# Altium project Watch.PrjPcb
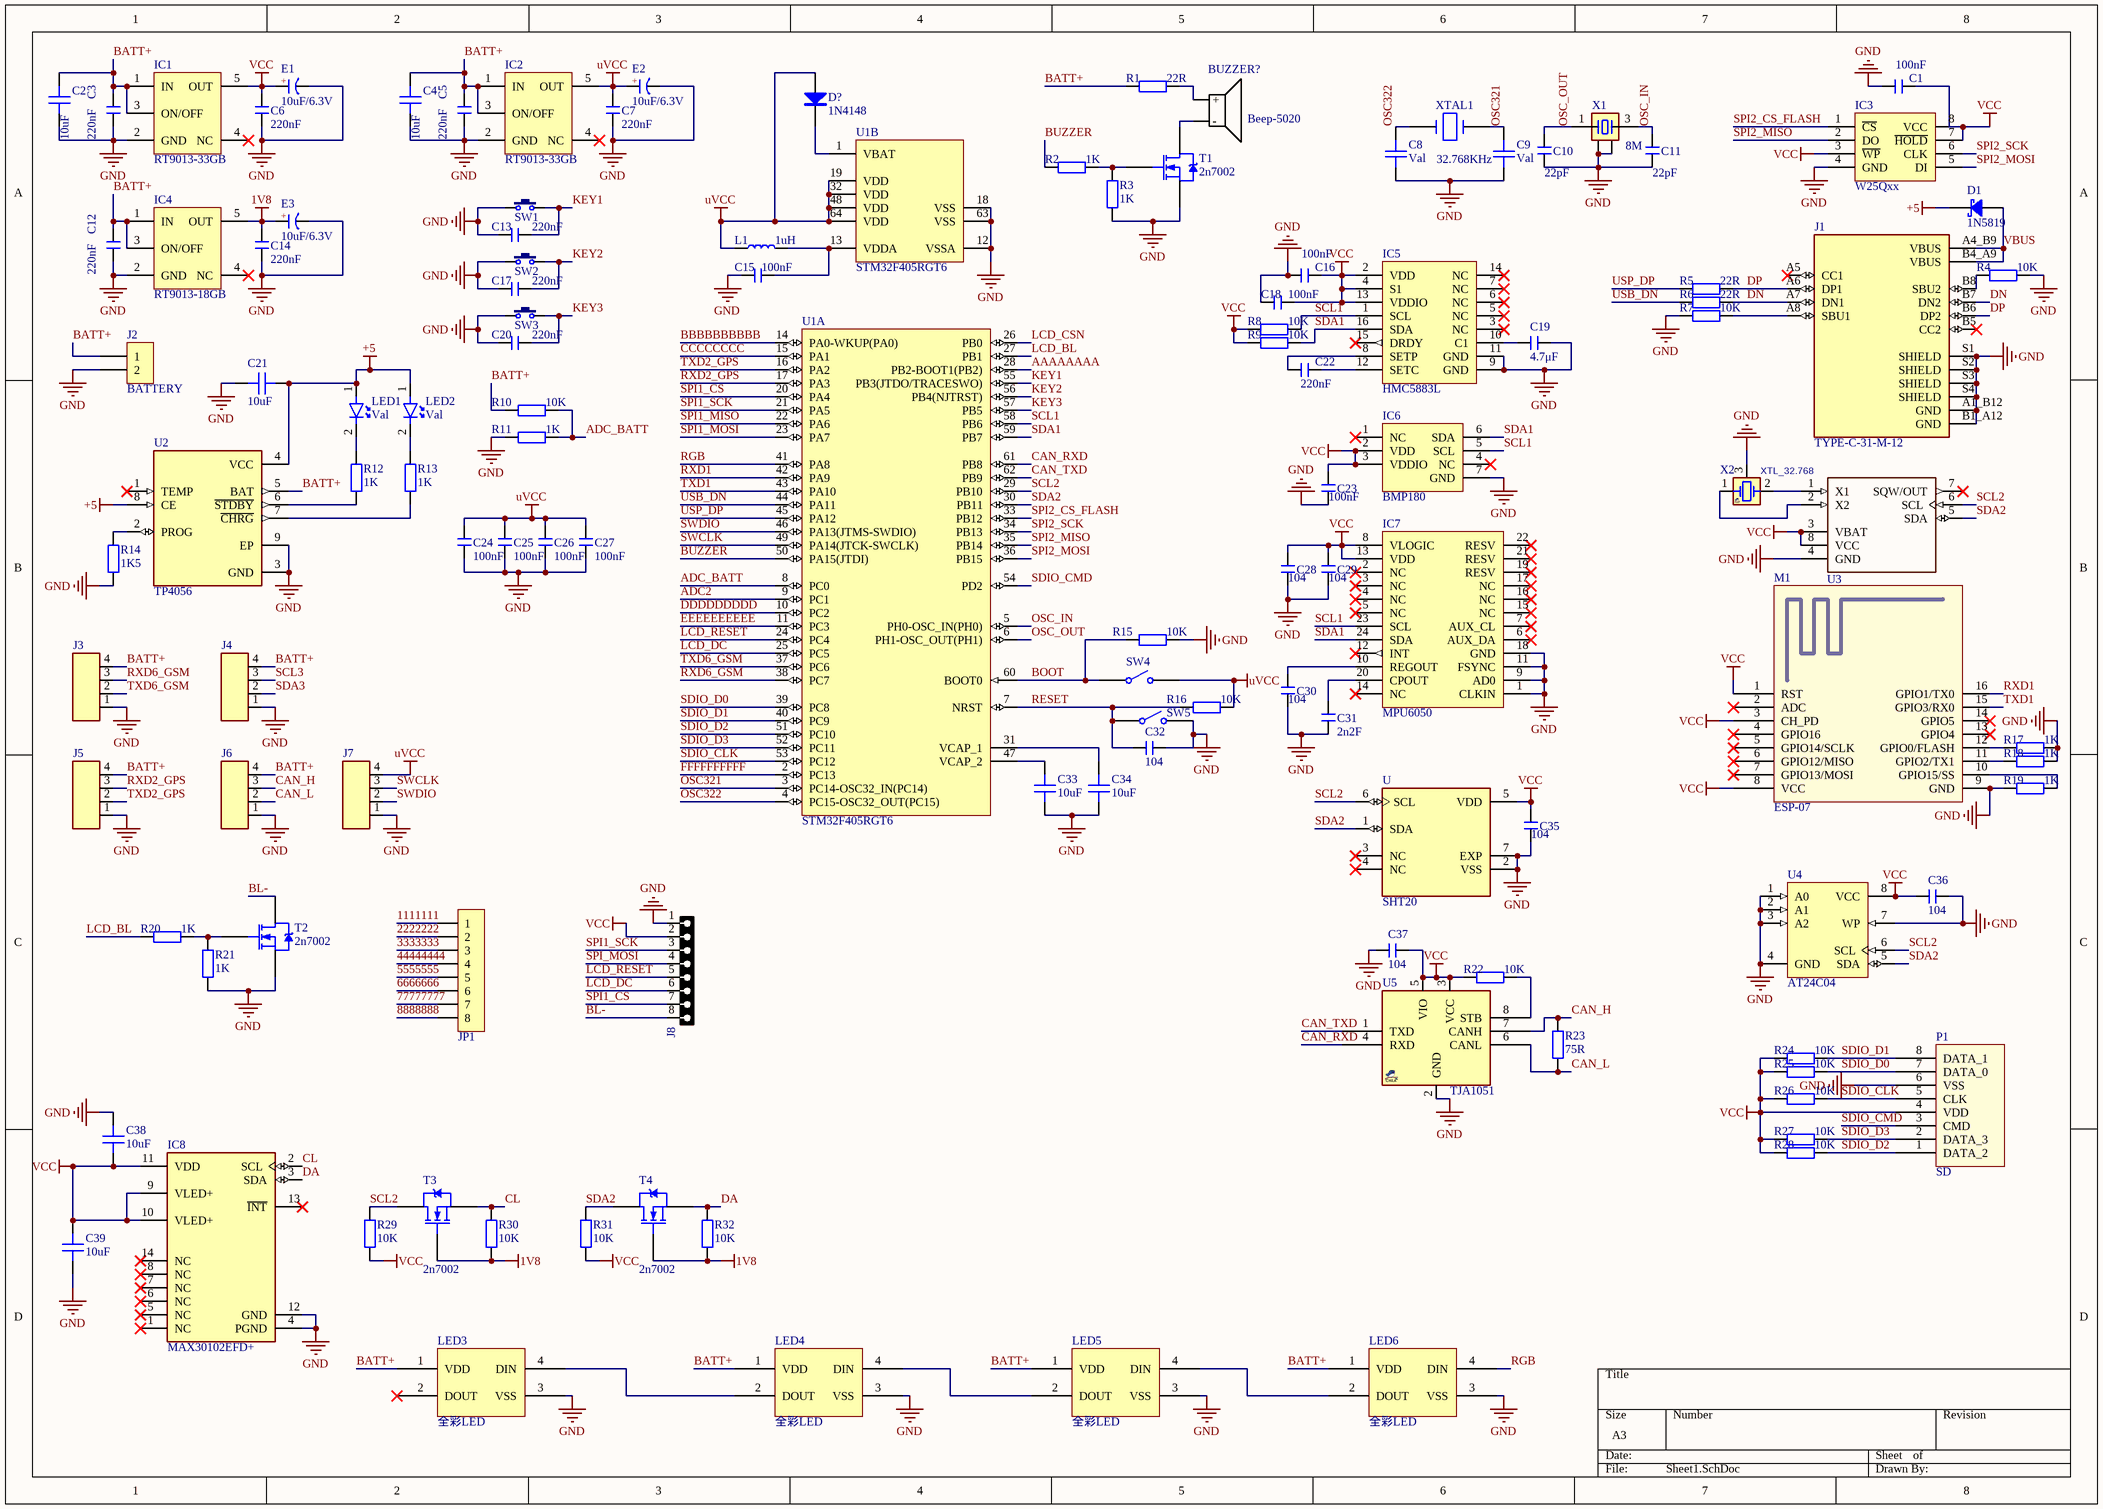
[diagram p0: Sheet1.SchDoc]
1 sheet, 121 parts. Net scope: global (net labels, ports and power ports of the same name join across sheets).
Board file: PCB1.PcbDoc

## Sheet Sheet1.SchDoc
size A3

### Parts
BUZZER?  Beep-5020  [5020BUZZER]
C1  100nF  [C 0603_L]
C2  10uF  [CAP 0805_2012]
C3  220nF  [C 0603_L]
C4  10uF  [CAP 0805_2012]
C5  220nF  [C 0603_L]
C6  220nF  [C 0603_L]
C7  220nF  [C 0603_L]
C8  Val  [C0402]
C9  Val  [C0402]
C10  22pF  [C 0603_L]
C11  22pF  [C 0603_L]
C12  220nF  [C 0603_L]
C13  220nF  [C 0603_L]
C14  220nF  [C 0603_L]
C15  100nF  [C 0603_L]
C16  100nF  [C 0603_L]
C17  220nF  [C 0603_L]
C18  100nF  [C 0603_L]
C19  4.7μF  [C 0603_L]
C20  220nF  [C 0603_L]
C21  10uF  [CAP 0805_2012]
C22  220nF  [C 0603_L]
C23  100nF  [C 0603_L]
C24  100nF  [C 0603_L]
C25  100nF  [C 0603_L]
C26  100nF  [C 0603_L]
C27  100nF  [C 0603_L]
C28  104  [C 0603_L]
C29  104  [C 0603_L]
C30  104  [C 0603_L]
C31  2n2F  [C 0603_L]
C32  104  [C 0603_L]
C33  10uF  [CAP 0805_2012]
C34  10uF  [CAP 0805_2012]
C35  104  [C 0603_L]
C36  104  [C 0603_L]
C37  104  [C 0603_L]
C38  10uF  [CAP 0805_2012]
C39  10uF  [CAP 0805_2012]
D1  1N5819  [SOD-123]
D?  1N4148  [SOD-323]
E1  10uF/6.3V  [CD A(3216)]
E2  10uF/6.3V  [CD A(3216)]
E3  10uF/6.3V  [CD A(3216)]
IC1  RT9013-33GB  [SOT-23-5_MC_MCH]
IC2  RT9013-33GB  [SOT-23-5_MC_MCH]
IC3  W25Qxx  [SOP8W_N]
IC4  RT9013-18GB  [SOT-23-5_MC_MCH]
IC5  HMC5883L  [LPCC16_HNW]
IC6  BMP180  [BMP180]
IC7  MPU6050  [QFN24_4X4X0P9_IVS]
IC8  MAX30102EFD+  [FP-F143A5-1-MFG]
J1  TYPE-C-31-M-12  [HRO_TYPE-C-31-M-12]
J2  BATTERY  [battery connector]  (no BOM)
J3  DF13-4  [DF13_4S]  (value not drawn)
J4  DF13-4  [DF13_4S]  (value not drawn)
J5  DF13-4  [DF13_4S]  (value not drawn)
J6  DF13-4  [DF13_4S]  (value not drawn)
J7  DF13-4  [DF13_4S]  (value not drawn)
J8  HDRF8  [HDR_F_1X8]  (value not drawn)
JP1  FPC1.0-8P  [FPC0.5 2H-WS-8P]  (value not drawn)
L1  1uH  [IND 0805_2012]
LED1  Val  [LED_0603]
LED2  Val  [LED_0603]
LED3  全彩LED  [WS2812]
LED4  全彩LED  [WS2812]
LED5  全彩LED  [WS2812]
LED6  全彩LED  [WS2812]
M1  ESP-07  [ESP07]
P1  SD  [TF-01A]
R1  22R  [R 0603_L]
R2  1K  [R 0603_L]
R3  1K  [R 0603_L]
R4  10K  [R 0603_L]
R5  22R  [R 0603_L]
R6  22R  [R 0603_L]
R7  10K  [R 0603_L]
R8  10K  [R 0603_L]
R9  10K  [R 0603_L]
R10  10K  [R 0603_L]
R11  1K  [R 0603_L]
R12  1K  [R 0603_L]
R13  1K  [R 0603_L]
R14  1K5  [R 0603_L]
R15  10K  [R 0603_L]
R16  10K  [R 0603_L]
R17  1K  [R 0603_L]
R18  1K  [R 0603_L]
R19  1K  [R 0603_L]
R20  1K  [R 0603_L]
R21  1K  [R 0603_L]
R22  10K  [R 0603_L]
R23  75R  [R 0603_L]
R24  10K  [R 0603_L]
R25  10K  [R 0603_L]
R26  10K  [R 0603_L]
R27  10K  [R 0603_L]
R28  10K  [R 0603_L]
R29  10K  [R 0603_L]
R30  10K  [R 0603_L]
R31  10K  [R 0603_L]
R32  10K  [R 0603_L]
SW1  3  [KEY-SMD_UK-B0264-SP25Y]  (value not drawn)
SW2  3  [KEY-SMD_UK-B0264-SP25Y]  (value not drawn)
SW3  3  [KEY-SMD_UK-B0264-SP25Y]  (value not drawn)
SW4  WE-Tact Switches WS-TASV 434113043826  [434113043826]  (value not drawn)
SW5  WE-Tact Switches WS-TASV 434113043826  [434113043826]  (value not drawn)
T1  2n7002  [SOT-23-3]
T2  2n7002  [SOT-23-3]
T3  2n7002  [SOT-23-3]
T4  2n7002  [SOT-23-3]
U  SHT20  [XDCR_SHT20]
U1  STM32F405RGT6  [STM-LQFP64_N]  (parts A,B of 2)
U2  TP4056  [SOP127P600X175-9N]
U3  DS1307  [SOIC-8 4.9X3.9MM P1.27MM]  (value not drawn)
U4  AT24C04  [SOIC-8 4.9X3.9MM P1.27MM]
U5  TJA1051  [SO_8]
X1  8M  [OSC 5032-4P]
X2  XTL_32.768  [XTL_RTC]
XTAL1  32.768KHz  [ABS0732768KHZ7T]

### Nets
1V8: C14.2 E3.1(A) IC4.5(OUT) R30.1 R32.1 T3.1(G) T4.1(G)
+5: C21.2 D1.2 LED1.1(Anode) LED2.1(Anode) U2.4(VCC) U2.8(CE)
GND: C1.1 C2.1 C3.1 C4.1 C5.1 C6.1 C7.1 C8.1 C9.1 C10.1 C11.1 C12.1 C13.2 C14.1 C15.2 C16.1 C17.2 C18.1 C19.2 C20.2 C21.1 C23.1 C24.1 C25.1 C26.1 C27.1 C28.1 C29.1 C30.1 C31.1 C32.1 C33.1 C34.1 C35.1 C36.1 C37.2 C38.2 C39.1 E1.2(K) E2.2(K) E3.2(K) IC1.2(GND) IC2.2(GND) IC3.4(GND) IC4.2(GND) IC5.9(GND) IC5.11(GND) IC6.7(GND) IC7.1(CLKIN) IC7.9(AD0) IC7.11(FSYNC) IC7.18(GND) IC8.4(PGND) IC8.12(GND) J1.A1_B12(GND) J1.B1_A12(GND) J1.S1(SHIELD) J1.S2(SHIELD) J1.S3(SHIELD) J1.S4(SHIELD) J2.2 J3.1 J4.1 J5.1 J6.1 J7.1 J8.1 LED3.3(VSS) LED4.3(VSS) LED5.3(VSS) LED6.3(VSS) M1.9(GND) P1.6(VSS) R3.1 R4.2 R7.1 R11.1 R14.1 R15.2 R17.2 R18.2 R19.1 R21.1 SW1.1 SW2.1 SW3.1 SW5.2 T1.2(S) T2.2(S) U.2(VSS) U.7(EXP) U1.12(VSSA) U1.18(VSS) U1.63(VSS) U2.3(GND) U2.9(EP) U3.4(GND) U4.1(A0) U4.2(A1) U4.3(A2) U4.4(GND) U4.7(WP) U5.2(GND) X1.2 X1.4 X2.3(CASE)
uVCC: C7.2 C24.2 C25.2 C26.2 C27.2 D?.1(A) E2.1(A) IC2.5(OUT) J7.4 L1.1 R16.2 SW4.2 U1.19(VDD) U1.32(VDD) U1.48(VDD) U1.64(VDD)
VCC: C1.2 C6.2 C16.2 C18.2 C23.2 C28.2 C29.2 C35.2 C36.2 C37.1 C38.1 C39.2 E1.1(A) IC1.5(OUT) IC3.3(~{WP}) IC3.7(~{HOLD}) IC3.8(VCC) IC5.2(VDD) IC5.4(S1) IC5.13(VDDIO) IC6.2(VDD) IC6.3(VDDIO) IC7.8(VLOGIC) IC7.13(VDD) IC8.9(VLED+) IC8.10(VLED+) IC8.11(VDD) J8.2 M1.1(RST) M1.3(CH_PD) M1.8(VCC) P1.4(VDD) R8.1 R9.1 R22.1 R24.1 R25.1 R26.1 R27.1 R28.1 R29.1 R31.1 U.5(VDD) U3.3(VBAT) U3.8(VCC) U4.8(VCC) U5.3(VCC) U5.5(VIO)
1111111: JP1.1
2222222: JP1.2
3333333: JP1.3
5555555: JP1.5
6666666: JP1.6
8888888: JP1.8
44444444: JP1.4
77777777: JP1.7
AAAAAAAA: U1.28(PB2-BOOT1(PB2))
ADC2: U1.9(PC1)
ADC_BATT: R10.2 R11.2 U1.8(PC0)
BATT+: C2.2 C3.2 C4.2 C5.2 C12.2 IC1.1(IN) IC1.3(ON/OFF) IC2.1(IN) IC2.3(ON/OFF) IC4.1(IN) IC4.3(ON/OFF) J2.1 J3.4 J4.4 J5.4 J6.4 LED3.1(VDD) LED4.1(VDD) LED5.1(VDD) LED6.1(VDD) R1.1 R10.1 U2.5(BAT)
BBBBBBBBBB: U1.14(PA0-WKUP(PA0))
BL-: J8.8 T2.3(D)
BOOT: R15.1 SW4.1 U1.60(BOOT0)
BUZZER: R2.1 U1.50(PA15(JTDI))
CAN_H: J6.3 R23.2 U5.7(CANH)
CAN_L: J6.2 R23.1 U5.6(CANL)
CAN_RXD: U1.61(PB8) U5.4(RXD)
CAN_TXD: U1.62(PB9) U5.1(TXD)
CCCCCCCC: U1.15(PA1)
CL: IC8.2(SCL) R30.2 T3.2(S)
DA: IC8.3(SDA) R32.2 T4.2(S)
DDDDDDDDD: U1.10(PC2)
DN: J1.A7(DN1) J1.B7(DN2) R6.2
DP: J1.A6(DP1) J1.B6(DP2) R5.2
EEEEEEEEEE: U1.11(PC3)
FFFFFFFFFF: U1.2(PC13)
KEY1: C13.1 SW1.2 U1.55(PB3(JTDO/TRACESWO))
KEY2: C17.1 SW2.2 U1.56(PB4(NJTRST))
KEY3: C20.1 SW3.2 U1.57(PB5)
LCD_BL: R20.1 U1.27(PB1)
LCD_CSN: U1.26(PB0)
LCD_DC: J8.6 U1.25(PC5)
LCD_RESET: J8.5 U1.24(PC4)
OSC321: C9.2 U1.3(PC14-OSC32_IN(PC14)) XTAL1.2
OSC322: C8.2 U1.4(PC15-OSC32_OUT(PC15)) XTAL1.1
OSC_IN: C11.2 U1.5(PH0-OSC_IN(PH0)) X1.3
OSC_OUT: C10.2 U1.6(PH1-OSC_OUT(PH1)) X1.1
RESET: C32.2 R16.1 SW5.1 U1.7(NRST)
RGB: LED6.4(DIN) U1.41(PA8)
RXD1: M1.16(GPIO1/TX0) U1.42(PA9)
RXD2_GPS: J5.3 U1.17(PA3)
RXD6_GSM: J3.3 U1.38(PC7)
SCL1: IC5.1(SCL) IC6.5(SCL) IC7.23(SCL) R8.2 U1.58(PB6)
SCL2: R29.2 T3.3(D) U.6(SCL) U1.29(PB10) U3.6(SCL) U4.6(SCL)
SCL3: J4.3
SDA1: IC5.16(SDA) IC6.6(SDA) IC7.24(SDA) R9.2 U1.59(PB7)
SDA2: R31.2 T4.3(D) U.1(SDA) U1.30(PB11) U3.5(SDA) U4.5(SDA)
SDA3: J4.2
SDIO_CLK: P1.5(CLK) R26.2 U1.53(PC12)
SDIO_CMD: P1.3(CMD) U1.54(PD2)
SDIO_D0: P1.7(DATA_0) R25.2 U1.39(PC8)
SDIO_D1: P1.8(DATA_1) R24.2 U1.40(PC9)
SDIO_D2: P1.1(DATA_2) R28.2 U1.51(PC10)
SDIO_D3: P1.2(DATA_3) R27.2 U1.52(PC11)
SPI1_CS: J8.7 U1.20(PA4)
SPI1_MISO: U1.22(PA6)
SPI1_MOSI: U1.23(PA7)
SPI1_SCK: J8.3 U1.21(PA5)
SPI2_CS_FLASH: IC3.1(~{CS}) U1.33(PB12)
SPI2_MISO: IC3.2(DO) U1.35(PB14)
SPI2_MOSI: IC3.5(DI) U1.36(PB15)
SPI2_SCK: IC3.6(CLK) U1.34(PB13)
SPI_MOSI: J8.4
SWCLK: J7.3 U1.49(PA14(JTCK-SWCLK))
SWDIO: J7.2 U1.46(PA13(JTMS-SWDIO))
TXD1: M1.15(GPIO3/RX0) U1.43(PA10)
TXD2_GPS: J5.2 U1.16(PA2)
TXD6_GSM: J3.2 U1.37(PC6)
USB_DN: R6.1 U1.44(PA11)
USP_DP: R5.1 U1.45(PA12)
VBUS: D1.1 J1.A4_B9(VBUS) J1.B4_A9(VBUS)
NetBUZZER?_1: BUZZER?.1(+) R1.2
NetBUZZER?_2: BUZZER?.2(-) T1.3(D)
NetC15_1: C15.1 L1.2 U1.13(VDDA)
NetC19_1: C19.1 IC5.10(C1)
NetC22_1: C22.1 IC5.8(SETP)
NetC22_2: C22.2 IC5.12(SETC)
NetC30_2: C30.2 IC7.10(REGOUT)
NetC31_2: C31.2 IC7.20(CPOUT)
NetC33_2: C33.2 U1.47(VCAP_2)
NetC34_2: C34.2 U1.31(VCAP_1)
NetD?_2: D?.2(K) U1.1(VBAT)
NetJ1_A8: J1.A8(SBU1) R7.2
NetJ1_B8: J1.B8(SBU2) R4.1
NetLED1_2: LED1.2(Cathode) R12.2
NetLED2_2: LED2.2(Cathode) R13.2
NetLED3_4: LED3.4(DIN) LED4.2(DOUT)
NetLED4_4: LED4.4(DIN) LED5.2(DOUT)
NetLED5_4: LED5.4(DIN) LED6.2(DOUT)
NetM1_10: M1.10(GPIO15/SS) R19.2
NetM1_11: M1.11(GPIO2/TX1) R18.1
NetM1_12: M1.12(GPIO0/FLASH) R17.1
NetR2_2: R2.2 R3.2 T1.1(G)
NetR12_1: R12.1 U2.6(~{STDBY})
NetR13_1: R13.1 U2.7(~{CHRG})
NetR14_2: R14.2 U2.2(PROG)
NetR20_2: R20.2 R21.2 T2.1(G)
NetR22_2: R22.2 U5.8(STB)
NetU3_1: U3.1(X1) X2.2(OSC2)
NetU3_2: U3.2(X2) X2.1(OSC1)

Not connected (* = marked no-connect by the designer): IC1 4(NC)*; IC2 4(NC)*; IC4 4(NC)*; IC5 3(NC)* 5(NC)* 6(NC)* 7(NC)* 14(NC)* 15(DRDY)*; IC6 1(NC)* 4(NC)*; IC7 2(NC)* 3(NC)* 4(NC)* 5(NC)* 6(AUX_DA)* 7(AUX_CL)* 12(INT)* 14(NC)* 15(NC)* 16(NC)* 17(NC)* 19(RESV)* 21(RESV)* 22(RESV)*; IC8 1(NC)* 5(NC)* 6(NC)* 7(NC)* 8(NC)* 13(~{INT})* 14(NC)*; J1 A5(CC1)* B5(CC2)*; LED3 2(DOUT)*; M1 2(ADC)* 4(GPIO16)* 5(GPIO14/SCLK)* 6(GPIO12/MISO)* 7(GPIO13/MOSI)* 13(GPIO4)* 14(GPIO5)*; U 3(NC)* 4(NC)*; U2 1(TEMP)*; U3 7(SQW/OUT)*

### Notes on the sheet
- (in symbol C-CD) +

### Library data of the parts
BUZZER? = Beep-5020: 贴片蜂鸣器5020最小封装
C1 C3 C5-C7 C10-C20 C22-C32 C35-C37 = C: 无极性贴片电容; 版权归属: 源创客; BOM名称: 无极性贴片电容; 学习资源: www.ooocke.com
C2 C4 C21 C33 C34 C38 C39 = Cap 0805: SMT Capacitor; VALUE: 10uF
C8 C9 = C: ComponentLink1Description: Link; ComponentLink1URL: *; MPN: *
D1 = 1N5819 (SMD): Diode Schottky 40V 1A Surface Mount SOD-123  Speed Fast Recovery =< 500ns, > 200mA (Io); PartNumber: 1N5819HW-7-F
D? = 1N4148: 高速开关二极管; 版权归属: 源创客; BOM名称: 高速开关二极管; 学习资源: www.ooocke.com
E1-E3 = C-CD: 贴片钽电容; 版权归属: 源创客; BOM名称: 贴片钽电容; 学习资源: www.ooocke.com
IC1 IC2 IC4 = LP2981IM5: MPN: LP2981IM5-3.3/NOPB; ComponentLink1Description: Link; ComponentLink1URL: https://www.tme.eu/en/details/lp2981im5-3.3_nopb/ldo-unregulated-voltage-regulators/texas-instruments/
IC3 = W25Qxx: 外置Flash; 版权归属: 源创客; BOM名称: 外置Flash; 学习资源: www.ooocke.com
IC8 = MAX30102: IC SENSOR OXIMETER/HEARTRATE; Manufacturer: Maxim Integrated; Max Junction Temp: +90°C; Min Supply Voltage: 1.7V; Sensor Output: I2C; Operating Supply Current: 600uA; Max Supply Voltage: 2V; Package: F143A5-1; Manufacturer Part Number: MAX30102EFD+; Footprint Url: https://pdfserv.maximintegrated.com/land_patterns/90-0602.PDF; ComponentLink2URL: https://datasheets.maximintegrated.com/en/ds/MAX30102.pdf; Temperature: -40°C to +85°C; Device Class L2: unset; Mouser Description: Pulse Oximeter/Heart Rate Sensor, Oesip; Temperature Range High: +85°C; Automotive: No; Height: 1.65mm; Digikey Description: IC SENSOR OXIMETER/HEARTRATE; Category: IC; Lead Free: Yes; RoHS: TRUE; Temperature Range Low: -40°C; ComponentLink2Description: Datasheet; Octopart: https://octopart.com/max30102efd%2B-maxim+integrated-59568799; Device Class L3: unset; Device Class L1: Sensors
J1 = TYPE-C-31-M-12: USB Connectors 24 Receptacle 1 8.94*7.3mm RoHS; MF: HRO Electronics Co., Ltd.; Price: None; Value: *; SnapEDA_Link: https://www.snapeda.com/parts/TYPE-C-31-M-12/HRO+Electronics+Co.%252C+Ltd./view-part/?ref=snap; Package: Package; Availability: Not in stock; Check_prices: https://www.snapeda.com/parts/TYPE-C-31-M-12/HRO+Electronics+Co.%252C+Ltd./view-part/?ref=eda; MP: TYPE-C-31-M-12
J2 = 1x2_CONNECTOR
J3-J7 = DF13_4S: Connector DF13-4P-1.25H, DF13 4WAY pitch:1.25mm; MANF: Hirose; VALUE: DF13-4; MANF_P#: DF13-4P-1.25H
J8 = HDR_F_1X8: CONN, HEADER, Female, pitch: 2.54mm, 8POS; VALUE: HDRF8
JP1 = FPC-8P: FPC连接器; 版权归属: 源创客; BOM名称: FPC连接器; 学习资源: www.ooocke.com
L1 = Ind 0805: SMT Inductor; Value: 1uH
LED1 LED2 = LED
LED3-LED6 = WS2812
P1 = Micro SD_TF-01A: TF-01A / C91145; 联系卖家，免费查找封装: 唯一出售店铺网址https://shop463601444.taobao.com
R1-R32 = R: 贴片电阻; 版权归属: 源创客; BOM名称: 贴片电阻; 学习资源: www.ooocke.com
SW1-SW3 = TSW 2x4x3.5: 2x4x3.5轻触开关; 版权归属: 源创客; BOM名称: 2x4x3.5轻触开关; 学习资源: www.ooocke.com
SW4 SW5 = WE-Tact Switches WS-TASV 434113043826: WS-TASV J-Bend SMD Tact Switch 6.0X3.5 mm; Manufacturer: W¨¹rth Elektronik eiSos GmbH & Co.KG; ComponentLink1 Description: Manufacturer; ComponentLink2 Description: Datasheet; Creat by: Karrer Zheng; NoPins: 02; Creat Date: 5 March February 2014; partNo: 434113043826; ComponentLink1URL: http://www.we-online.com; ComponentLink2URL: http://katalog.we-online.de/em/datasheet/434113043826.pdf
U = SHT20: SENSOR HUMID/TEMP 3V I2C 3% SMD; MF: Sensirion AG; MP: SHT20; Package: DFN-6 Sensirion; Availability: Unavailable; Price: None; SnapEDA_Link: https://www.snapeda.com/parts/SHT20/Sensirion%20AG/view-part/53498/?ref=snap; Value: *
U1 = STM32F405RGT6: ARM Cortex-M4 32-bit MCU+FPU, 210 DMIPS, 1024 kB Flash, 192 kB Internal RAM, 51 I/Os, 64-pin LQFP, -40 to 85 degC, Tray; Manufacturer: STMicroelectronics; D/A Converter: 2x12-bit; FLASH Size (Prog) (kB): 1024; I/Os (High Current): 51; Internal RAM Size (kB): 192; Operating Frequency(F) (Processor speed) (MHz): 168; Supply Voltage(Vcc) max (V): 3.6; Supply Voltage(Vcc) min (V): 1.8; DatasheetVersion: Rev. 4; PackageVersion: Rev. 4, 06/2013; PackageReference: LQFP64; PackageDescription: 64-Pin Low Profile Quad Flat Package, 10 x 10 mm Body, 0.5 mm Pitch; Supplier 1: Digi-Key; Supplier Part Number 1: 497-11767-ND; Supplier 2: Farnell; Supplier Part Number 2: 2064363; Supplier 3: Newark; Supplier Part Number 3: 73T2329; Supplier 4: Mouser; Supplier Part Number 4: 511-STM32F405RGT6; Core: ARM Cortex-M4; Packing: Tray; Mounting Technology: Surface Mount; PartNumber: STM32F405RGT6; ComponentLink1Description: Manufacturer URL; ComponentLink1URL: http://www.st.com/web/en/home.html; ComponentLink2Description: Datasheet; ComponentLink2URL: http://www.st.com/st-web-ui/static/active/en/resource/technical/document/datasheet/DM00037051.pdf; ComponentLink3Description: Package Specification; ComponentLink3URL: http://www.st.com/st-web-ui/static/active/en/resource/technical/document/datasheet/DM00037051.pdf
U2 = TP4056: Complete single cell Li-Ion battery with a constant current / constant voltage linear charger; MF: NanJing Top Power ASIC Corp.; Check_prices: https://www.snapeda.com/parts/TP4056/NanJing+Top+Power+ASIC+Corp./view-part/?ref=eda; SnapEDA_Link: https://www.snapeda.com/parts/TP4056/NanJing+Top+Power+ASIC+Corp./view-part/?ref=snap; Price: None; Availability: Not in stock; Package: Package; MP: TP4056; Value: *
U3 = DS1307 (SMD): Real Time Clock (RTC) IC Clock/Calendar 56B I²C, 2-Wire Serial 8-SOIC (0.154", 3.90mm Width); PartNumber: DS1307ZN+T&R
U4 = AT24C04 (SMD SOIC): EEPROM Memory IC 4Kb (128 x 8) I²C 1MHz 550ns (1.7~5.5V)  8-SOIC; PartNumber: AT24C04C-SSHM-T
U5 = TJA1051_SOP8: CAN, phy, High sp 5Mbps, 5V (VDD), 3/5V (VIO); MANF: NXP; MANF_P#: TJA1051T; PARAM2: 5V (VDD), 3/5V (VIO), 12/24V SYSTEM; PRICE: 3500toman@PAYA; PARAM: PARAM; VALUE: TJA1051
X1 = XTAL-4P: 4脚无源晶振; 版权归属: 源创客; BOM名称: 4脚无源晶振; 学习资源: www.ooocke.com
X2 = XTL_3_32.768_SMD: Crystal MOST POPULAR PACKAGE; MANF: ABRACON; MANF_P#: AB26T-32.768KHZ; PARAM2: 12pF; PARAM: 20PPM, -40~85°C; VALUE: XTL_32.768
XTAL1 = CRYSTAL_OSC_2PINS: MPN: ABS07-32.768KHZ-7-T; ComponentLink1Description: Link; ComponentLink1URL: https://www.tme.eu/pl/details/abs07-32.768khz-7/rezonatory-kwarcowe-smd/abracon/abs07-32-768khz-7-t/
IC5 = HMC5883L: ComponentLink1Description: Link; ComponentLink1URL: https://cdn-shop.adafruit.com/datasheets/HMC5883L_3-Axis_Digital_Compass_IC.pdf; MPN: HMC5883L
IC6 = BMP180: MPN: BMP180; ComponentLink1Description: Link; ComponentLink1URL: https://cdn-shop.adafruit.com/datasheets/BST-BMP180-DS000-09.pdf
IC7 = MPU6050: MPN: MPU6050; ComponentLink1Description: Link; ComponentLink1URL: https://product.tdk.com/system/files/dam/doc/product/sensor/mortion-inertial/imu/data_sheet/mpu-6000-datasheet1.pdf